# Altium project SW-RPi-CM4.PrjPcb
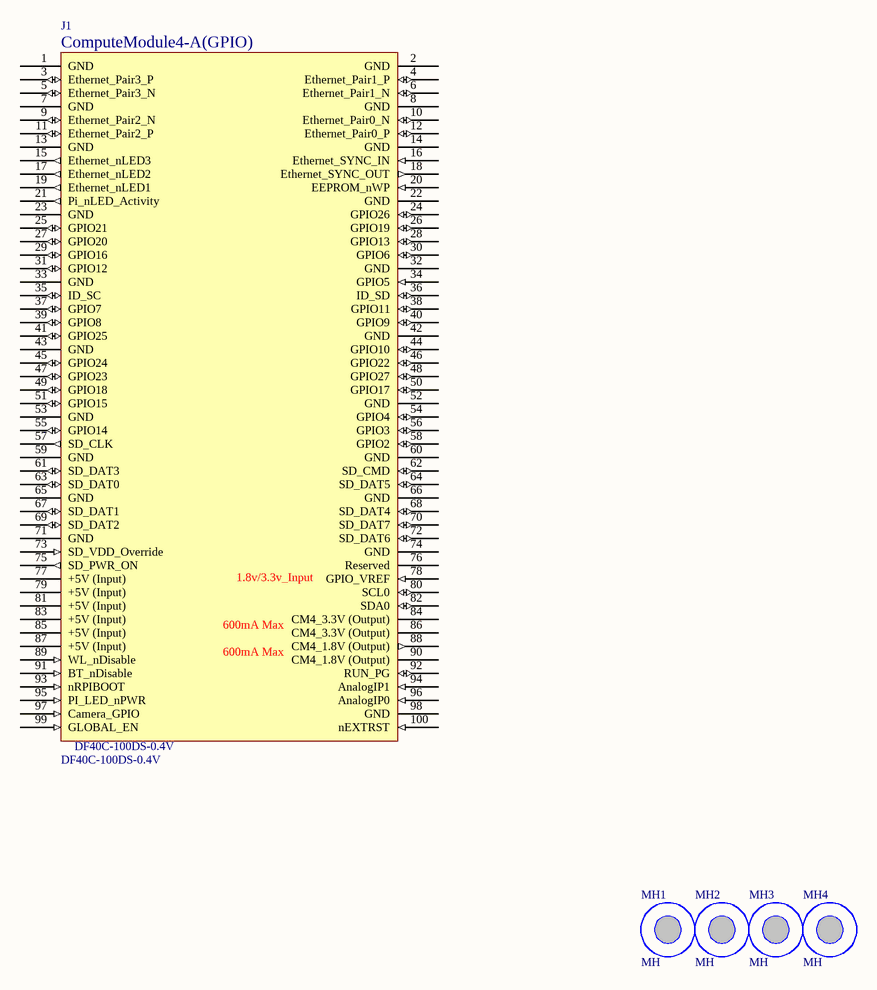
[diagram p0: CM4_GPIO.SchDoc]
Author: Leihonglun; ProjectTitle: CM4_Template; Revision: V0I0
2 sheets, 6 parts. Net scope: global (net labels, ports and power ports of the same name join across sheets).
Board file: CM4_Connector.PcbDoc
Sheets:
  CM4_GPIO.SchDoc
  CM4_HighSpeed.SchDoc

## Sheet CM4_GPIO.SchDoc: CM4_GPIO
size A4; SheetNumber: 1; SheetTotal: 2

### Parts
J1  DF40C-100DS-0.4V  [DF40C100DS04V51(CM4-A)]
MH1  MH  [M2.5]
MH2  MH  [M2.5]
MH3  MH  [M2.5]
MH4  MH  [M2.5]

### Nets

Not connected (* = marked no-connect by the designer): J1 1(GND) 2(GND) 3(Ethernet_Pair3_P) 4(Ethernet_Pair1_P) 5(Ethernet_Pair3_N) 6(Ethernet_Pair1_N) 7(GND) 8(GND) 9(Ethernet_Pair2_N) 10(Ethernet_Pair0_N) 11(Ethernet_Pair2_P) 12(Ethernet_Pair0_P) 13(GND) 14(GND) 15(Ethernet_nLED3) 16(Ethernet_SYNC_IN) 17(Ethernet_nLED2) 18(Ethernet_SYNC_OUT) 19(Ethernet_nLED1) 20(EEPROM_nWP) 21(Pi_nLED_Activity) 22(GND) 23(GND) 24(GPIO26) 25(GPIO21) 26(GPIO19) 27(GPIO20) 28(GPIO13) 29(GPIO16) 30(GPIO6) 31(GPIO12) 32(GND) 33(GND) 34(GPIO5) 35(ID_SC) 36(ID_SD) 37(GPIO7) 38(GPIO11) 39(GPIO8) 40(GPIO9) 41(GPIO25) 42(GND) 43(GND) 44(GPIO10) 45(GPIO24) 46(GPIO22) 47(GPIO23) 48(GPIO27) 49(GPIO18) 50(GPIO17) 51(GPIO15) 52(GND) 53(GND) 54(GPIO4) 55(GPIO14) 56(GPIO3) 57(SD_CLK) 58(GPIO2) 59(GND) 60(GND) 61(SD_DAT3) 62(SD_CMD) 63(SD_DAT0) 64(SD_DAT5) 65(GND) 66(GND) 67(SD_DAT1) 68(SD_DAT4) 69(SD_DAT2) 70(SD_DAT7) 71(GND) 72(SD_DAT6) 73(SD_VDD_Override) 74(GND) 75(SD_PWR_ON) 76(Reserved) 77(+5V_(Input)) 78(GPIO_VREF) 79(+5V_(Input)) 80(SCL0) 81(+5V_(Input)) 82(SDA0) 83(+5V_(Input)) 84(CM4_3.3V_(Output)) 85(+5V_(Input)) 86(CM4_3.3V_(Output)) 87(+5V_(Input)) 88(CM4_1.8V_(Output)) 89(WL_nDisable) 90(CM4_1.8V_(Output)) 91(BT_nDisable) 92(RUN_PG) 93(nRPIBOOT) 94(AnalogIP1) 95(PI_LED_nPWR) 96(AnalogIP0) 97(Camera_GPIO) 98(GND) 99(GLOBAL_EN) 100(nEXTRST)

### Notes on the sheet
- Sheet Title:
- Project Title:
- Date:
- Revision:
- Time:
- Variant:
- Size:
- Sheet
- A4
- of
- www.soundwedge.com.hk <http://www.soundwedge.com.hk>
- File:
- Author:
- (in symbol RPi-CM4-A) ComputeModule4-A(GPIO); 1.8v/3.3v_Input; 600mA Max

### Library data of the parts
J1 = RPi-CM4-A: CM4-A GPIO
MH1-MH4 = MH: 安装孔-附加安装铜柱信息

## Sheet CM4_HighSpeed.SchDoc: CM4_HighSpeed
size A4; SheetNumber: 2; SheetTotal: 2
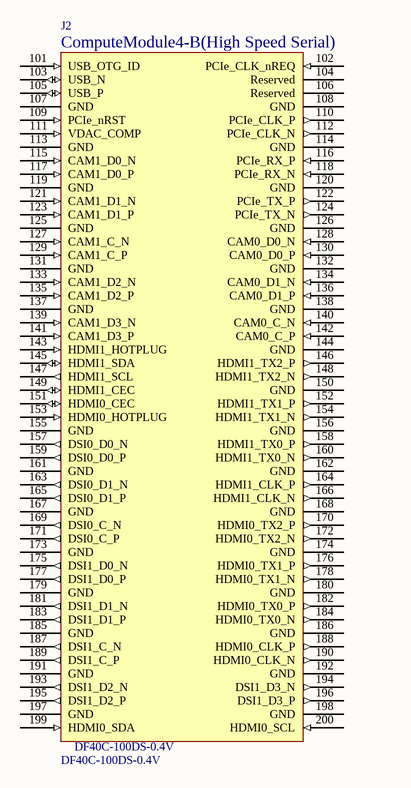
[diagram p1: CM4_HighSpeed.SchDoc]

### Parts
J2  DF40C-100DS-0.4V  [DF40C100DS04V51(CM4-B)]

### Nets

Not connected (* = marked no-connect by the designer): J2 101(USB_OTG_ID) 102(PCIe_CLK_nREQ) 103(USB_N) 104(Reserved) 105(USB_P) 106(Reserved) 107(GND) 108(GND) 109(PCIe_nRST) 110(PCIe_CLK_P) 111(VDAC_COMP) 112(PCIe_CLK_N) 113(GND) 114(GND) 115(CAM1_D0_N) 116(PCIe_RX_P) 117(CAM1_D0_P) 118(PCIe_RX_N) 119(GND) 120(GND) 121(CAM1_D1_N) 122(PCIe_TX_P) 123(CAM1_D1_P) 124(PCIe_TX_N) 125(GND) 126(GND) 127(CAM1_C_N) 128(CAM0_D0_N) 129(CAM1_C_P) 130(CAM0_D0_P) 131(GND) 132(GND) 133(CAM1_D2_N) 134(CAM0_D1_N) 135(CAM1_D2_P) 136(CAM0_D1_P) 137(GND) 138(GND) 139(CAM1_D3_N) 140(CAM0_C_N) 141(CAM1_D3_P) 142(CAM0_C_P) 143(HDMI1_HOTPLUG) 144(GND) 145(HDMI1_SDA) 146(HDMI1_TX2_P) 147(HDMI1_SCL) 148(HDMI1_TX2_N) 149(HDMI1_CEC) 150(GND) 151(HDMI0_CEC) 152(HDMI1_TX1_P) 153(HDMI0_HOTPLUG) 154(HDMI1_TX1_N) 155(GND) 156(GND) 157(DSI0_D0_N) 158(HDMI1_TX0_P) 159(DSI0_D0_P) 160(HDMI1_TX0_N) 161(GND) 162(GND) 163(DSI0_D1_N) 164(HDMI1_CLK_P) 165(DSI0_D1_P) 166(HDMI1_CLK_N) 167(GND) 168(GND) 169(DSI0_C_N) 170(HDMI0_TX2_P) 171(DSI0_C_P) 172(HDMI0_TX2_N) 173(GND) 174(GND) 175(DSI1_D0_N) 176(HDMI0_TX1_P) 177(DSI1_D0_P) 178(HDMI0_TX1_N) 179(GND) 180(GND) 181(DSI1_D1_N) 182(HDMI0_TX0_P) 183(DSI1_D1_P) 184(HDMI0_TX0_N) 185(GND) 186(GND) 187(DSI1_C_N) 188(HDMI0_CLK_P) 189(DSI1_C_P) 190(HDMI0_CLK_N) 191(GND) 192(GND) 193(DSI1_D2_N) 194(DSI1_D3_N) 195(DSI1_D2_P) 196(DSI1_D3_P) 197(GND) 198(GND) 199(HDMI0_SDA) 200(HDMI0_SCL)

### Notes on the sheet
- Sheet Title:
- Project Title:
- Date:
- Revision:
- Time:
- Variant:
- Size:
- Sheet
- A4
- of
- www.soundwedge.com.hk <http://www.soundwedge.com.hk>
- File:
- Author:
- (in symbol RPi-CM4-B) ComputeModule4-B(High Speed Serial)

### Library data of the parts
J2 = RPi-CM4-B: CM4-B High Speed Serial